# EAGLE design chicken_hw (EAGLE 6.6.0)
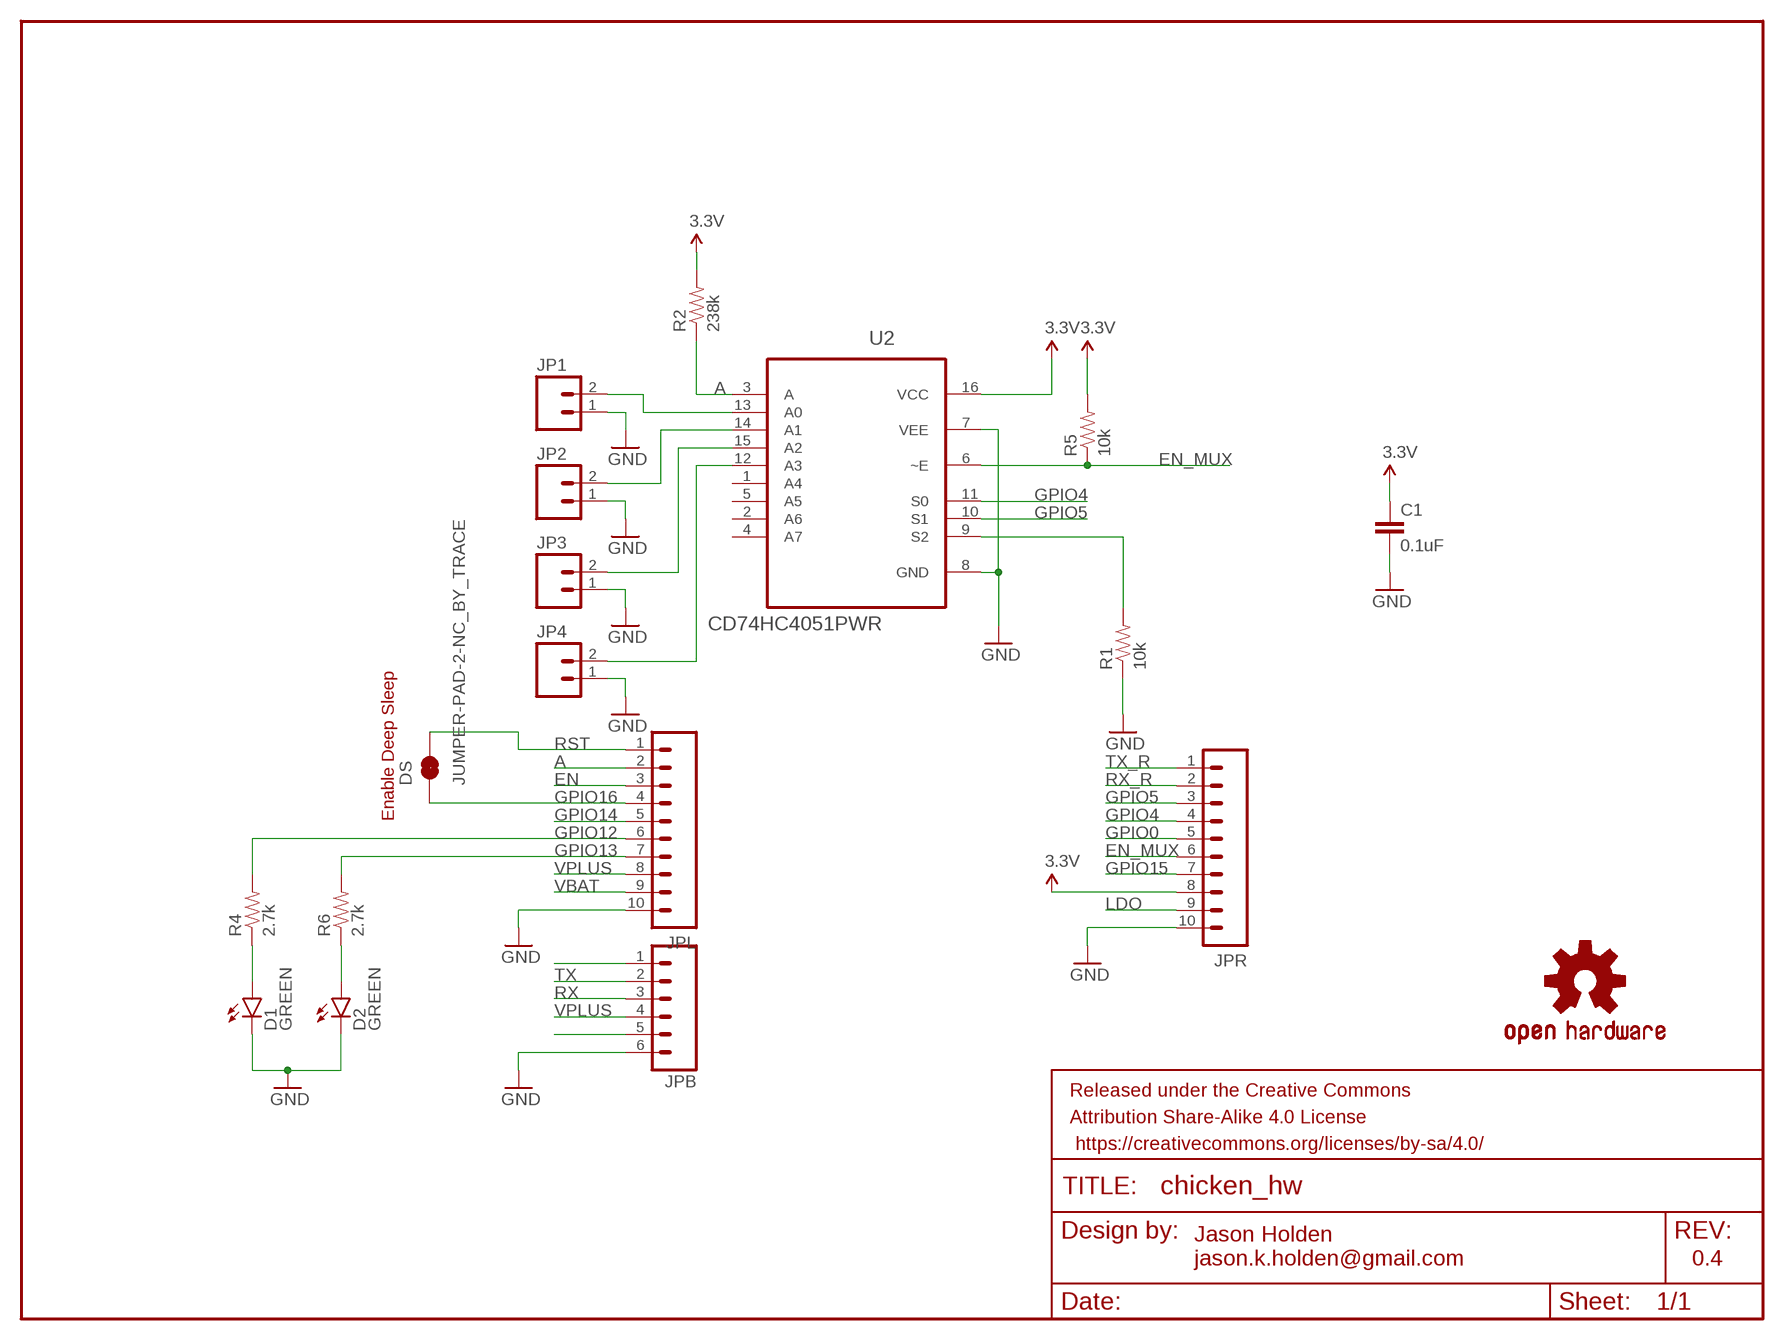
[diagram p0: schematic, sheet 1]

## Parts
C1  0.1uF  CAP0603-CAP  [0603-CAP]
D1  GREEN  LED-GREEN0603  [LED-0603]
D2  GREEN  LED-GREEN0603  [LED-0603]
DS  JUMPER-PAD-2-NC_BY_TRACE  [PAD-JUMPER-2-NC_BY_TRACE_YES_SILK]
FRAME1  FRAME-LETTER  [CREATIVE_COMMONS]
JP1  M02PTH  [1X02]
JP2  M02PTH  [1X02]
JP3  M02PTH  [1X02]
JP4  M02PTH  [1X02]
JPB  M06SILK_FEMALE_PTH  [1X06]
JPL  M10SILK_FEMALE_PTH  [1X10]
JPR  M10SILK_FEMALE_PTH  [1X10]
LOGO1  OSHW-LOGOS  [OSHW-LOGO-S]
R1  10k  RESISTOR0603  [0603-RES]
R2  238k  RESISTOR0603  [0603-RES]
R4  2.7k  RESISTOR0603  [0603-RES]
R5  10k  RESISTOR0603  [0603-RES]
R6  2.7k  RESISTOR0603  [0603-RES]
U2  CD74HC4051PWR  [SOP65P640X120-16N]

## Nets
3.3V: C1.1 JPR.8 R2.2 R5.2 U2.16(VCC)
A: JPL.2 R2.1 U2.3(A)
EN: JPL.3
EN_MUX: JPR.6 R5.1 U2.6(~E)
GND: C1.2 D1.C D2.C JP1.1 JP2.1 JP3.1 JP4.1 JPB.6 JPL.10 JPR.10 R1.1 U2.7(VEE) U2.8(GND)
GPIO0: JPR.5
GPIO4: JPR.4 U2.11(S0)
GPIO5: JPR.3 U2.10(S1)
GPIO12: JPL.6 R4.2
GPIO13: JPL.7 R6.2
GPIO14: JPL.5
GPIO15: JPR.7
GPIO16: DS.1 JPL.4
LDO: JPR.9
N$1: R1.2 U2.9(S2)
N$2: JP1.2 U2.13(A0)
N$3: JP2.2 U2.14(A1)
N$4: JP3.2 U2.15(A2)
N$5: JP4.2 U2.12(A3)
N$8: D1.A R4.1
N$9: D2.A R6.1
N$11: JPB.1
N$23: JPB.5
RST: DS.2 JPL.1
RX: JPB.3
RX_R: JPR.2
TX: JPB.2
TX_R: JPR.1
VBAT: JPL.9
VPLUS: JPB.4 JPL.8
Unconnected: U2.1(A4) U2.2(A6) U2.4(A7) U2.5(A5)

## Notes on the sheet
- Enable Deep Sleep
- Jason Holden
  jason.k.holden@gmail.com
- 0.4

## Library data of the parts
C1 = SparkFun-Capacitors:CAP: Capacitor Standard 0603 ceramic capacitor, and 0.1" leaded capacitor.
D1 D2 = SparkFun-LED:LED-GREEN: Various green LEDs Green LEDs used in SFE Production 0603- DIO-00821 LARGE- DIO-00862 LILYPAD- DIO-09910; PROD_ID: DIO-00821
DS = SparkFun-Passives:JUMPER-PAD-2-NC_BY_TRACE
FRAME1 = SparkFun-Aesthetics:FRAME-LETTER: Schematic Frame Standard 8.5x11 US Letter frame
JP1-JP4 = SparkFun-Connectors:M02: Standard 2-pin 0.1" header. Use with - straight break away headers ( PRT-00116) - right angle break away headers (PRT-00553) - swiss pins (PRT-00743) - machine pins (PRT-00117) - female headers (PRT-00115) Molex polarized connector foot print use with: PRT-08233 with associated crimp pins and housings. 2.54_SCREWTERM for use with PRT-10571. 3.5mm Screw Terminal footprints for PRT-08084 5mm Screw Terminal footprints for use with PRT-08432
JPB = SparkFun-Connectors:M06: Header 6 Standard 6-pin 0.1" header. Use with straight break away headers (SKU : PRT-00116), right angle break away headers (PRT-00553), swiss pins (PRT-00743), machine pins (PRT-00117), and female headers (PRT-00115). Molex polarized connector foot print use with SKU : PRT-08094 with associated crimp pins and housings. NOTES ON THE VARIANTS LOCK and LOCK_LONGPADS... This footprint was designed to help hold the alignment of a through-hole component (i.e. 6-pin header) while soldering it into place. You may notice that each hole has been shifted either up or down by 0.005 of an inch from it's more standard position (which is a perfectly straight line). This slight alteration caused the pins (the squares in the middle) to touch the edges of the holes. Because they are alternating, it causes a "brace" to hold the component in place. 0.005 has proven to be the perfect amount of "off-center" position when using our standard breakaway headers. Although looks a little odd when you look at the bare footprint, once you have a header in there, the alteration is very hard to notice. Also,if you push a header all the way into place, it is covered up entirely on the bottom side. This idea of altering the position of holes to aid alignment will be further integrated into the Sparkfun Library for other footprints. It can help hold any component with 3 or more connection pins.; PROD_ID: CONN-08437
JPL JPR = SparkFun-Connectors:M10: Header 10 Standard 10-pin 0.1" header. Use with straight break away headers (SKU : PRT-00116), right angle break away headers (PRT-00553), swiss pins (PRT-00743), machine pins (PRT-00117), and female headers (PRT-00115).; PROD_ID: CONN-11563
LOGO1 = SparkFun-Aesthetics:OSHW-LOGO: Open Source Hardware Logo This logo indicates the piece of hardware it is found on incorporates a OSHW license and/or adheres to the definition of open source hardware found here: http://freedomdefined.org/OSHW
R1 R2 R4-R6 = SparkFun-Resistors:RESISTOR: Resistor Basic schematic elements and footprints for 0603, 1206, and PTH resistors.
U2 = Texas Instruments_By_element14_Batch_1:CD74HC4051PWR: High-Speed CMOS Logic Analog Multiplexers/Demultiplexers; MPN: CD74HC4051PWR; OC_FARNELL: 8389071; OC_NEWARK: 38K0244; PACKAGE: TSSOP-16; SUPPLIER: Texas Instruments

## Net classes
0 default: width 0.254 mm

## Board
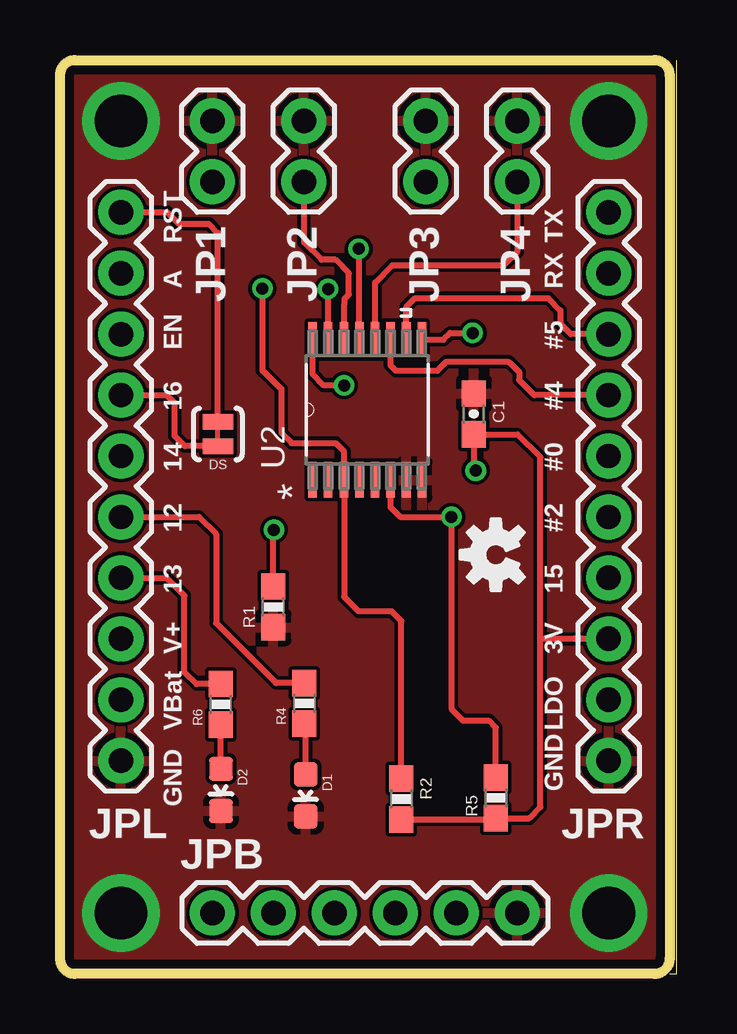
[diagram p1: board, top side]
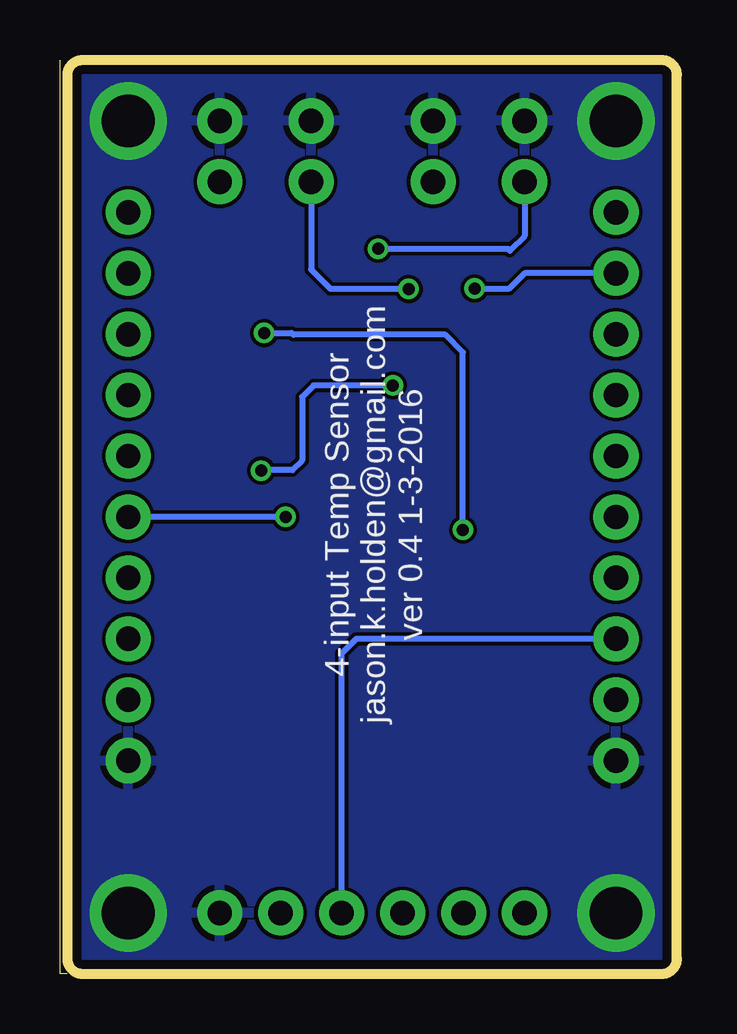
[diagram p2: board, bottom side, seen from below]

Size 25.7 x 38.1 mm. Coordinates in mm from the lower left corner, seen from the top.
Outline: 25.4,0 25.7,0 25.7,38.09
Outline: 0,37.47 arc-90 0.64,38.1 24.77,38.1 arc-90 25.4,37.47 25.4,0.64 arc-90 24.77,0 0.64,0 arc-90 0,0.64 0,37.47
Copper layers (1*16): Top 0.0356mm / dielectric 1.5011mm / Bottom 0.0356mm
Design rules "LaenPCBOrder": minimum track width 6mil, minimum drill 13mil, track to track 6mil, track to pad 6mil, pad to pad 6mil, via to via 6mil, smd to smd 6mil, copper to edge 15mil, drill to drill 6mil, minimum pad ring 7mil, minimum via ring 7mil, stop-mask expansion 3mil, vias tented up to drill 0mil, thermal gap 10mil

### Footprints (pad centres in the part's own frame; a part is rotated, then mirrored left to right if it is on the bottom)
0603-CAP = smd 1.1 x 1: 1 -0.85,0; 2 0.85,0
LED-0603 = smd 1 x 1: A 0,-0.877; C 0,0.877
PAD-JUMPER-2-NC_BY_TRACE_YES_SILK = smd 0.635 x 1.27: 1 -0.508,0; 2 0.508,0
1X02 = drill 1.016 pad 1.88: 1 0,0; 2 2.54,0
1X06 = drill 1.016 pad 1.88: 1 0,0; 2 2.54,0; 3 5.08,0; 4 7.62,0; 5 10.16,0; 6 12.7,0
1X10 = drill 1.016 pad 1.88: 1 0,0; 2 2.54,0; 3 5.08,0; 4 7.62,0; 5 10.16,0; 6 12.7,0; 7 15.24,0; 8 17.78,0; 9 20.32,0; 10 22.86,0
0603-RES = smd 1.1 x 1: 1 -0.85,0; 2 0.85,0
SOP65P640X120-16N = smd 1.473 x 0.356: 1 -2.921,2.286; 2 -2.921,1.626; 3 -2.921,0.965; 4 -2.921,0.33; 5 -2.921,-0.33; 6 -2.921,-0.965; 7 -2.921,-1.626; 8 -2.921,-2.286; 9 2.921,-2.286; 10 2.921,-1.626; 11 2.921,-0.965; 12 2.921,-0.33; 13 2.921,0.33; 14 2.921,0.965; 15 2.921,1.626; 16 2.921,2.286

### Placement (x,y rotation side)
C1  17.25,23.34 90 top
D1  10.24,7.44 180 top
D2  6.71,7.67 180 top
DS  6.58,22.5 90 top
FRAME1  -3.94,-9.6 0 top  (outside the outline)
JP1  6.35,35.56 270 top
JP2  10.16,35.56 270 top
JP3  15.24,35.56 270 top
JP4  19.05,35.56 270 top
JPB  6.35,2.54 0 top
JPL  2.54,31.75 270 top
JPR  22.86,31.75 270 top
LOGO1  18.16,17.48 90 top
R1  8.89,15.3 90 top
R2  14.22,7.29 270 top
R4  10.19,11.28 90 top
R5  18.16,7.34 270 top
R6  6.71,11.24 90 top
U2  12.8,23.52 90 top

### Tracks (layer width: path | path; a pad name or v marks a point on that pad's centre or on a via)
3.3V  (via drill 0.5)
  Top 0.254: R2.2 18.11,6.44 R5.2 19.55,6.49 20.02,6.96 20.02,13.97 | 20.02,13.97 20.02,21.54 19.06,22.49 C1.1 17.25,21.06 v17.32,20.98 | JPR.8 20.02,13.97 | U2.16 10.52,25.02 11,24.54 v11.84,24.54
  Bottom 0.254: v11.84,24.54 15.14,24.54 15.62,24.05 15.62,21.41 16.03,21.01 17.3,21.01 v17.32,20.98
A  (via drill 0.5 pad 0.25)
  Top 0.254: v8.43,28.57 8.43,25.15 8.46,25.15 9.22,24.38 9.22,22.55 9.65,22.12 11.48,22.12 11.84,21.77 U2.3 11.84,15.72 12.45,15.11 13.82,15.11 14.22,14.71 R2.1
  Bottom 0.254: v8.43,28.57 6.99,28.57 6.35,29.21 JPL.2
EN_MUX  (via drill 0.5 pad 0.25)
  Top 0.254: U2.6 13.77,19.46 14.17,19.05 v16.31,19.05 16.31,11.05 16.79,10.57 17.86,10.57 18.16,10.26 R5.1
  Bottom 0.254: v16.31,19.05 JPR.6
GND  (via drill 2.2)
  other vias: 2.54,35.56 22.86,35.56 22.86,2.54 2.54,2.54
  pour Top: 0,38.1 0,0 25.4,0 25.4,38.1
  pour Bottom: 0,38.1 0,0 25.4,0 25.4,38.1
GPIO4
  Top 0.254: U2.11 13.77,25.38 13.99,25.15 15.72,25.15 16.1,25.53 18.67,25.53 18.72,25.48 18.75,25.48 19.13,25.09 19.13,24.77 19.76,24.13 JPR.4
GPIO5
  Top 0.254: U2.10 14.43,27.81 14.78,28.17 20.34,28.17 20.85,27.66 20.85,27.1 20.9,27.05 21.29,26.67 JPR.3
GPIO12
  Top 0.254: JPL.6 5.79,19.05 6.5,18.34 6.5,14.63 9.01,12.13 R4.2
GPIO13
  Top 0.254: R6.2 5.69,12.09 5.18,12.6 5.18,15.77 4.45,16.51 JPL.7
GPIO16
  Top 0.254: DS.1 5.21,22 4.78,22.43 4.78,23.8 4.45,24.13 JPL.4
N$1  (via drill 0.5)
  Top 0.254: R1.2 8.89,18.49 v8.91,18.52 | U2.9 15.98,26.44 16.26,26.72 v17.2,26.72
  Bottom 0.254: v8.91,18.52 8.91,25.91 9.65,26.64 15.98,26.64 16.05,26.72 v17.2,26.72
N$2  (via drill 0.5 pad 0.25)
  Top 0.254: U2.13 12.47,30.2 v12.45,30.23
  Bottom 0.254: v12.45,30.23 7.04,30.23 6.96,30.15 6.35,30.76 JP1.2
N$3
  Top 0.254: U2.14 11.84,27.91 11.86,27.94 11.86,28.14 12.04,28.32 12.04,29.21 11.48,29.77 10.9,29.77 10.16,30.5 JP2.2
N$4  (via drill 0.5 pad 0.25)
  Top 0.254: U2.15 v11.18,28.55
  Bottom 0.254: v11.18,28.55 14.43,28.55 15.24,29.36 JP3.2
N$5
  Top 0.254: U2.12 13.13,28.83 13.84,29.54 18.49,29.54 19.05,30.1 JP4.2
N$8
  Top 0.254: D1.A 10.24,10.38 R4.1
N$9
  Top 0.254: D2.A R6.1
RST
  Top 0.254: JPL.1 4.47,31.75 4.95,31.27 6.2,31.27 6.58,30.89 DS.2
VPLUS
  Bottom 0.254: JPL.8 13.36,13.97 13.97,13.36 JPB.4

### Text on the board
tPlace: RST | TX | A | RX | EN | #5 | 16 | #4 | 14 | #0 | 12 | #2 | 13 | 15 | V+ | 3V | VBat | LDO | GND | GND
bPlace: 4-input Temp Sensor / jason.k.holden@gmail.com / ver 0.4 1-3-2016
tDocu: Jason Holden / jason.k.holden@gmail.com